# EAGLE board SimpleKeyboardTeensy (EAGLE 7.7.0), part 1 of 2
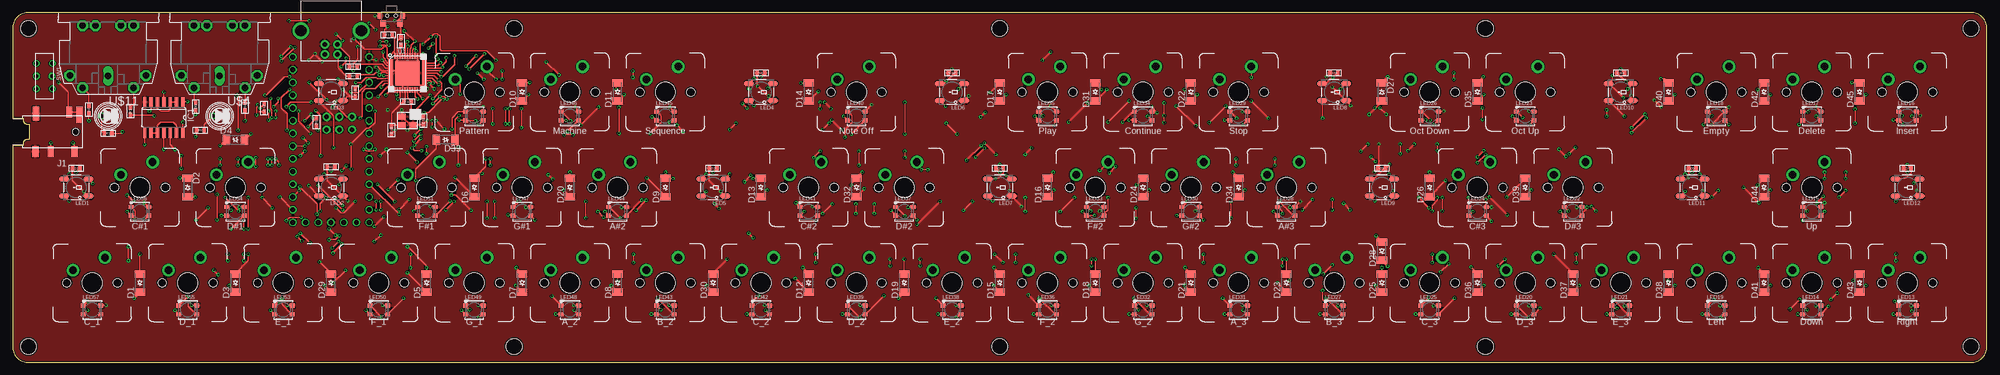
[diagram p3: board, top side]
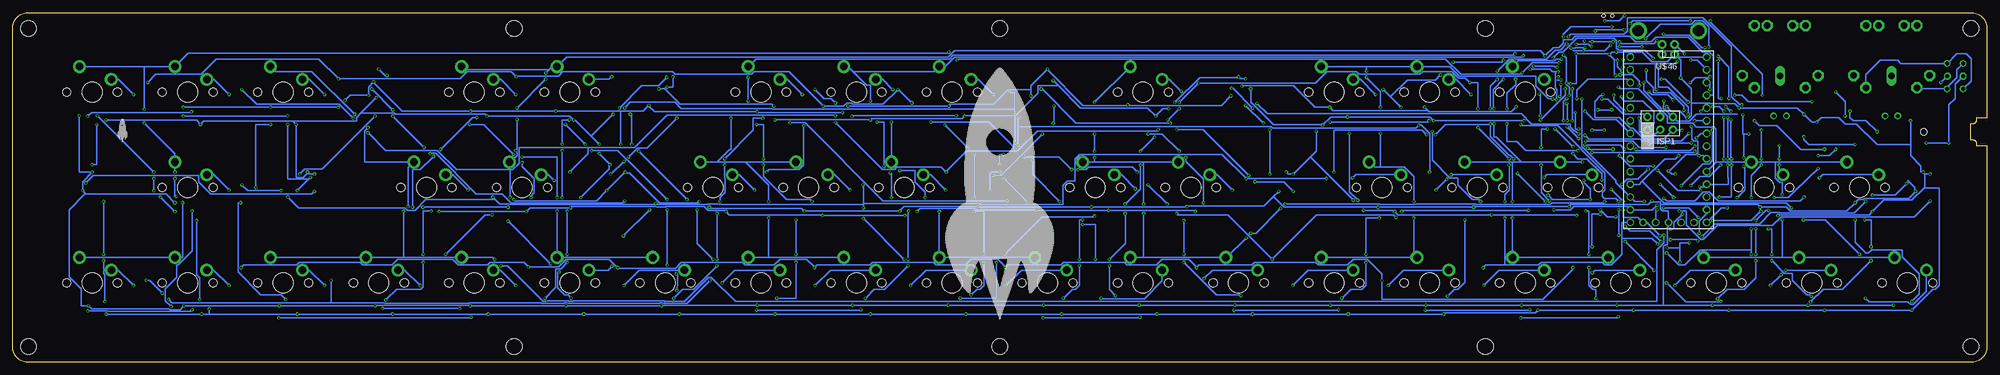
[diagram p4: board, bottom side, seen from below]

Size 393.7 x 69.85 mm. Coordinates in mm from the lower left corner, seen from the top.
Outline: 0,66.67 0,48.77 2.16,48.77 2.16,48.26 arc90 2.79,47.62 3.3,47.62 3.3,44.45 2.79,44.45 arc90 2.16,43.81 2.16,43.31 0,43.31 0,3.17 arc90 3.17,0 390.53,0 arc90 393.7,3.17 393.7,66.67 arc90 390.53,69.85 3.17,69.85 arc90 0,66.67
Copper layers (1*16): Top 0.035mm / dielectric 1.5mm / Bottom 0.035mm
Design rules "dirt_cheap_dirty_boards.v1": minimum track width 5mil, minimum drill 12mil, track to track 5mil, track to pad 5mil, pad to pad 5mil, via to via 5mil, smd to smd 0mil, copper to edge 10mil, drill to drill 10mil, minimum pad ring 10mil, minimum via ring 6mil, stop-mask expansion 2mil, vias tented up to drill 25mil, thermal gap 10mil
Net classes: 0 default: width 0.254 mm; 1 power: width 0.381 mm
Holes 3.2 mm at 3.17,66.67 3.17,3.17 390.53,66.67 196.85,3.17 196.85,66.67 390.53,3.17 100.01,3.17 100.01,66.67 293.69,3.17 293.69,66.67

## Footprints (pad centres in the part's own frame; a part is rotated, then mirrored left to right if it is on the bottom)
C0603 = smd 0.889 x 0.889: 1 -0.762,0; 2 0.762,0
SOD-123_MINI-SMA = smd 1.5 x 2.1: A 1.8,0; C -1.8,0
3MMLED = drill 0.8: + -1.27,0; - 1.27,0
SO14 = smd 0.66 x 2.032: 1 -3.81,-3.073; 2 -2.54,-3.073; 3 -1.27,-3.073; 4 0,-3.073; 5 1.27,-3.073; 6 2.54,-3.073; 7 3.81,-3.073; 8 3.81,3.073; 9 2.54,3.073; 10 1.27,3.073; 11 0,3.073; 12 -1.27,3.073; 13 -2.54,3.073; 14 -3.81,3.073
AVRISP = drill 0.9 pad 1.626: 1 -1.27,2.54; 2 1.27,2.54; 3 -1.27,0; 4 1.27,0; 5 -1.27,-2.54; 6 1.27,-2.54
6P-SMD-3.5 = smd 1.27 x 2.286: COM1 2.413,3.937; L -4.318,-3.937; R -0.635,3.937; RS -5.334,3.937 | smd 1.27 x 2.794: COM2 2.286,-3.683 | smd 1.27 x 3.302: LS -6.35,-3.429 | hole 1.27: -5.588,0
USB-B-PTH = drill 0.914 pad 1.676: D+ 0,1.25; D- 1.981,1.25; GND 0,-1.25; VBUS 1.981,-1.25 | drill 2.286: S1 -2.718,-6.02; S2 -2.718,6.02
WS2812B = smd 2 x 1.1: DIN -2.4,-1.7; DOUT 2.4,1.7; VDD 2.4,-1.7; VSS -2.4,1.7
LED3535 = smd 1 x 0.85: 1 -1.75,0.875; 2 -1.75,-0.875; 3 1.75,-0.875; 4 1.75,0.875
R0603 = smd 0.889 x 0.889: 1 -0.762,0; 2 0.762,0
6P-2CH-2.54-9.1X3.5X3.2+2H = drill 0.813 pad 1.27: CH1A -2.54,-1.6; CH1B 2.54,-1.6; CH2A -2.54,1.6; CH2B 2.54,1.6 | drill 0.813 pad 1.27 octagon: COM1 0,-1.6; COM2 0,1.524
MX1A-XXNW = drill 1.5 pad 2.54: 1 -3.81,2.54; 2 2.54,5.08 | hole 4: 0,0 | hole 1.7: -5.08,0; 5.08,0
QFN44 = smd 1 x 0.3: 1 -3.35,2.5; 2 -3.35,2; 3 -3.35,1.5; 4 -3.35,1; 5 -3.35,0.5; 6 -3.35,0; 7 -3.35,-0.5; 8 -3.35,-1; 9 -3.35,-1.5; 10 -3.35,-2; 11 -3.35,-2.5; 23 3.35,-2.5; 24 3.35,-2; 25 3.35,-1.5; 26 3.35,-1; 27 3.35,-0.5; 28 3.35,0; 29 3.35,0.5; 30 3.35,1; 31 3.35,1.5; 32 3.35,2; 33 3.35,2.5 | smd 0.3 x 1: 12 -2.5,-3.35; 13 -2,-3.35; 14 -1.5,-3.35; 15 -1,-3.35; 16 -0.5,-3.35; 17 0,-3.35; 18 0.5,-3.35; 19 1,-3.35; 20 1.5,-3.35; 21 2,-3.35; 22 2.5,-3.35; 34 2.5,3.35; 35 2,3.35; 36 1.5,3.35; 37 1,3.35; 38 0.5,3.35; 39 0,3.35; 40 -0.5,3.35; 41 -1,3.35; 42 -1.5,3.35; 43 -2,3.35; 44 -2.5,3.35 | smd 5.08 x 5.08: TAB 0,0
CP-2350 = drill 1.321 pad 2.184 octagon: 1 7.62,12.58; 3 -7.52,12.58; 4 5.08,15.02; 5 -5.08,15.02; PE -2.54,2.62; PE1 -5.08,2.62; PE2 5.08,2.62; PE@ 2.54,2.62 | drill 1.321 long: 2 0,12.68
TEENSY_3_AND_LC_SERIES_BOARDS_V1.4_TEENSY_3.0-3.2&LC_OUTER_ROW = drill 0.965: 0 -7.62,13.97; 1 -7.62,11.43; 2 -7.62,8.89; 3 -7.62,6.35; 3.3V 7.62,11.43; 3.3V1 -2.54,-16.51; 4 -7.62,3.81; 5 -7.62,1.27; 6 -7.62,-1.27; 7 -7.62,-3.81; 8 -7.62,-6.35; 9 -7.62,-8.89; 10 -7.62,-11.43; 11 -7.62,-13.97; 12 -7.62,-16.51; 13 7.62,-16.51; 14/A0 7.62,-13.97; 15/A1 7.62,-11.43; 16/A2 7.62,-8.89; 17/A3 7.62,-6.35; 18/A4 7.62,-3.81; 19/A5 7.62,-1.27; 20/A6 7.62,1.27; 21/A7 7.62,3.81; 22/A8 7.62,6.35; 23/A9 7.62,8.89; AGND 7.62,13.97; GND -7.62,16.51; GND1 0,-16.51; PGM 2.54,-16.51; RESET/DAC 5.08,-16.51; VBAT -5.08,-16.51; VIN 7.62,16.51
16MHZXTAL = smd 1.4 x 1.2: P$1 -1.1,-0.85; P$2 1.1,-0.85; P$3 1.1,0.85; P$4 -1.1,0.85
2X4TACT = smd 1.15 x 1.3: A -1.675,-1.55; B 1.675,-1.55 | smd 0.9 x 1.2: G1 -2.3,0; G2 2.3,0 | hole 0.7: -0.85,0; 0.85,0

## Placement (x,y rotation side)
C1  100n  [C0603]  12.7,38.73 0 top
C2  100n  [C0603]  63.5,39.05 0 top
C3  100n  [C0603]  139.7,38.73 0 top
C4  100n  [C0603]  196.85,38.73 0 top
C5  100n  [C0603]  273.05,38.73 0 top
C6  100n  [C0603]  334.96,38.73 0 top
C7  100n  [C0603]  377.82,38.73 0 top
C8  100n  [C0603]  149.23,57.78 0 top
C9  100n  [C0603]  263.53,57.78 0 top
C10  100n  [C0603]  187.33,57.78 0 top
C11  100n  [C0603]  320.68,57.78 0 top
C12  100n  [C0603]  50.16,50.8 90 top
C13  100n  [C0603]  77.47,64.14 90 top
C14  1u  [C0603]  68.33,53.85 270 top
C15  22p  [C0603]  81.91,48.26 270 top
C16  22p  [C0603]  75.56,46.35 270 top
D1  CGRM4001-G  [SOD-123_MINI-SMA]  25.4,15.88 90 top
D2  CGRM4001-G  [SOD-123_MINI-SMA]  34.92,34.92 270 top
D3  CGRM4001-G  [SOD-123_MINI-SMA]  44.45,15.88 90 top
D4  CGRM4001-G  [SOD-123_MINI-SMA]  44.45,44.45 0 top
D5  CGRM4001-G  [SOD-123_MINI-SMA]  82.55,15.88 90 top
D6  CGRM4001-G  [SOD-123_MINI-SMA]  92.08,34.92 90 top
D7  CGRM4001-G  [SOD-123_MINI-SMA]  101.6,15.88 90 top
D8  CGRM4001-G  [SOD-123_MINI-SMA]  120.65,15.88 90 top
D9  CGRM4001-G  [SOD-123_MINI-SMA]  130.18,34.92 90 top
D10  CGRM4001-G  [SOD-123_MINI-SMA]  101.6,53.97 90 top
D11  CGRM4001-G  [SOD-123_MINI-SMA]  120.65,53.97 90 top
D12  CGRM4001-G  [SOD-123_MINI-SMA]  158.75,15.88 90 top
D13  CGRM4001-G  [SOD-123_MINI-SMA]  149.23,34.92 90 top
D14  CGRM4001-G  [SOD-123_MINI-SMA]  158.75,53.97 90 top
D15  CGRM4001-G  [SOD-123_MINI-SMA]  196.85,15.88 90 top
D16  CGRM4001-G  [SOD-123_MINI-SMA]  206.38,34.92 90 top
D17  CGRM4001-G  [SOD-123_MINI-SMA]  196.85,53.97 90 top
D18  CGRM4001-G  [SOD-123_MINI-SMA]  215.9,15.88 90 top
D19  CGRM4001-G  [SOD-123_MINI-SMA]  177.8,15.88 90 top
D20  CGRM4001-G  [SOD-123_MINI-SMA]  111.12,34.92 90 top
D21  CGRM4001-G  [SOD-123_MINI-SMA]  234.95,15.88 90 top
D22  CGRM4001-G  [SOD-123_MINI-SMA]  234.95,53.97 90 top
D23  CGRM4001-G  [SOD-123_MINI-SMA]  254,15.88 90 top
D24  CGRM4001-G  [SOD-123_MINI-SMA]  225.43,34.92 90 top
D25  CGRM4001-G  [SOD-123_MINI-SMA]  273.05,15.88 90 top
D26  CGRM4001-G  [SOD-123_MINI-SMA]  282.57,34.92 90 top
D27  CGRM4001-G  [SOD-123_MINI-SMA]  273.05,53.97 270 top
D28  CGRM4001-G  [SOD-123_MINI-SMA]  273.05,22.23 90 top
D29  CGRM4001-G  [SOD-123_MINI-SMA]  63.5,15.88 90 top
D30  CGRM4001-G  [SOD-123_MINI-SMA]  139.7,15.88 90 top
D31  CGRM4001-G  [SOD-123_MINI-SMA]  215.9,53.97 90 top
D32  CGRM4001-G  [SOD-123_MINI-SMA]  168.28,34.92 90 top
D33  CGRM4001-G  [SOD-123_MINI-SMA]  86.36,44.45 180 top
D34  CGRM4001-G  [SOD-123_MINI-SMA]  244.48,34.92 90 top
D35  CGRM4001-G  [SOD-123_MINI-SMA]  292.1,53.97 90 top
D36  CGRM4001-G  [SOD-123_MINI-SMA]  292.1,15.88 90 top
D37  CGRM4001-G  [SOD-123_MINI-SMA]  311.15,15.88 90 top
D38  CGRM4001-G  [SOD-123_MINI-SMA]  330.2,15.88 90 top
D39  CGRM4001-G  [SOD-123_MINI-SMA]  301.62,34.92 90 top
D40  CGRM4001-G  [SOD-123_MINI-SMA]  330.2,53.97 90 top
D41  CGRM4001-G  [SOD-123_MINI-SMA]  349.25,15.88 90 top
D42  CGRM4001-G  [SOD-123_MINI-SMA]  349.25,53.97 90 top
D43  CGRM4001-G  [SOD-123_MINI-SMA]  368.3,15.88 90 top
D44  CGRM4001-G  [SOD-123_MINI-SMA]  349.25,34.92 90 top
D45  CGRM4001-G  [SOD-123_MINI-SMA]  368.3,53.97 90 top
D46  [3MMLED]  41.27,49.21 0 top
D47  [3MMLED]  19.05,49.21 0 top
IC1  74AC04D  [SO14]  30.16,48.89 180 top
ISP1  AVRISP-6  [AVRISP]  65.15,47.75 90 bottom
J1  AUDIO-CONNECTOR-6P-SMD-3440030P1  [6P-SMD-3.5]  6.98,46.04 180 top
JP1  USB-B  [USB-B-PTH]  63.5,63.5 270 top
LED1  WS2812B  [WS2812B]  12.7,34.92 180 top
LED2  WS2812B  [WS2812B]  63.5,34.92 180 top
LED3  WS2812B  [WS2812B]  63.5,53.97 180 top
LED4  WS2812B  [WS2812B]  149.23,53.97 180 top
LED5  WS2812B  [WS2812B]  139.7,34.92 180 top
LED6  WS2812B  [WS2812B]  187.33,53.97 180 top
LED7  WS2812B  [WS2812B]  196.85,34.92 180 top
LED8  WS2812B  [WS2812B]  263.53,53.97 180 top
LED9  WS2812B  [WS2812B]  273.05,34.92 180 top
LED10  WS2812B  [WS2812B]  320.68,53.97 180 top
LED11  WS2812B  [WS2812B]  334.96,34.92 180 top
LED12  WS2812B  [WS2812B]  377.82,34.92 180 top
LED13  WS2812B3535  [LED3535]  377.82,10.48 0 top
LED14  WS2812B3535  [LED3535]  358.78,10.48 0 top
LED15  WS2812B3535  [LED3535]  358.78,30.16 0 top
LED16  WS2812B3535  [LED3535]  377.82,49.21 0 top
LED17  WS2812B3535  [LED3535]  358.78,49.21 0 top
LED18  WS2812B3535  [LED3535]  339.73,49.21 0 top
LED19  WS2812B3535  [LED3535]  339.73,10.48 0 top
LED20  WS2812B3535  [LED3535]  301.62,10.48 0 top
LED21  WS2812B3535  [LED3535]  320.68,10.48 0 top
LED22  WS2812B3535  [LED3535]  311.15,30.16 0 top
LED23  WS2812B3535  [LED3535]  301.62,49.21 0 top
LED24  WS2812B3535  [LED3535]  292.1,30.16 0 top
LED25  WS2812B3535  [LED3535]  282.57,10.48 0 top
LED26  WS2812B3535  [LED3535]  282.57,49.21 0 top
LED27  WS2812B3535  [LED3535]  263.53,10.48 0 top
LED28  WS2812B3535  [LED3535]  254,30.16 0 top
LED29  WS2812B3535  [LED3535]  244.48,49.21 0 top
LED30  WS2812B3535  [LED3535]  234.95,30.16 0 top
LED31  WS2812B3535  [LED3535]  244.48,10.48 0 top
LED32  WS2812B3535  [LED3535]  225.43,10.48 0 top
LED33  WS2812B3535  [LED3535]  215.9,30.16 0 top
LED34  WS2812B3535  [LED3535]  225.43,49.21 0 top
LED35  WS2812B3535  [LED3535]  206.38,49.21 0 top
LED36  WS2812B3535  [LED3535]  206.38,10.48 0 top
LED37  WS2812B3535  [LED3535]  177.8,30.16 0 top
LED38  WS2812B3535  [LED3535]  187.33,10.48 0 top
LED39  WS2812B3535  [LED3535]  168.28,10.48 0 top
LED40  WS2812B3535  [LED3535]  168.28,49.21 0 top
LED41  WS2812B3535  [LED3535]  158.75,30.16 0 top
LED42  WS2812B3535  [LED3535]  149.23,10.48 0 top
LED43  WS2812B3535  [LED3535]  130.18,10.48 0 top
LED44  WS2812B3535  [LED3535]  120.65,30.16 0 top
LED45  WS2812B3535  [LED3535]  130.18,49.21 0 top
LED46  WS2812B3535  [LED3535]  111.12,49.21 0 top
LED47  WS2812B3535  [LED3535]  101.6,30.16 0 top
LED48  WS2812B3535  [LED3535]  111.12,10.48 0 top
LED49  WS2812B3535  [LED3535]  92.08,10.48 0 top
LED50  WS2812B3535  [LED3535]  73.02,10.48 0 top
LED51  WS2812B3535  [LED3535]  82.55,30.16 0 top
LED52  WS2812B3535  [LED3535]  92.08,49.21 0 top
LED53  WS2812B3535  [LED3535]  53.97,10.48 0 top
LED54  WS2812B3535  [LED3535]  44.45,30.16 0 top
LED55  WS2812B3535  [LED3535]  34.92,10.48 0 top
LED56  WS2812B3535  [LED3535]  25.4,30.16 0 top
LED57  WS2812B3535  [LED3535]  15.88,10.48 0 top
R1  330  [R0603]  19.05,45.72 180 top
R2  330  [R0603]  37.46,46.35 0 top
R3  220  [R0603]  23.5,50.16 270 top
R4  220  [R0603]  46.35,51.12 270 top
R5  220  [R0603]  15.24,50.48 90 top
R6  220  [R0603]  36.51,51.12 90 top
R7  22  [R0603]  67.94,57.15 180 top
R8  22  [R0603]  67.94,59.05 180 top
R9  10k  [R0603]  60.58,48.01 90 top
R10  1M  [R0603]  78.74,52.07 180 top
R11  10k  [R0603]  74.93,65.41 180 top
SW1  SWITCH-2CH-6P-3010010P1  [6P-2CH-2.54-9.1X3.5X3.2+2H]  6.35,57.15 270 top
SW46  C_1  [MX1A-XXNW]  15.88,15.88 0 top
SW47  C#1  [MX1A-XXNW]  25.4,34.92 0 top
SW48  D_1  [MX1A-XXNW]  34.92,15.88 0 top
SW49  D#1  [MX1A-XXNW]  44.45,34.92 0 top
SW50  E_1  [MX1A-XXNW]  53.97,15.88 0 top
SW51  F_1  [MX1A-XXNW]  73.02,15.88 0 top
SW52  F#1  [MX1A-XXNW]  82.55,34.92 0 top
SW53  G_1  [MX1A-XXNW]  92.08,15.88 0 top
SW54  G#1  [MX1A-XXNW]  101.6,34.92 0 top
SW55  A_2  [MX1A-XXNW]  111.12,15.88 0 top
SW56  A#2  [MX1A-XXNW]  120.65,34.92 0 top
SW57  B_2  [MX1A-XXNW]  130.18,15.88 0 top
SW58  C_2  [MX1A-XXNW]  149.23,15.88 0 top
SW59  C#2  [MX1A-XXNW]  158.75,34.92 0 top
SW60  D_2  [MX1A-XXNW]  168.28,15.88 0 top
SW61  D#2  [MX1A-XXNW]  177.8,34.92 0 top
SW62  E_2  [MX1A-XXNW]  187.33,15.88 0 top
SW63  F_2  [MX1A-XXNW]  206.38,15.88 0 top
SW64  F#2  [MX1A-XXNW]  215.9,34.92 0 top
SW65  G_2  [MX1A-XXNW]  225.43,15.88 0 top
SW66  G#2  [MX1A-XXNW]  234.95,34.92 0 top
SW67  A_3  [MX1A-XXNW]  244.48,15.88 0 top
SW68  A#3  [MX1A-XXNW]  254,34.92 0 top
SW69  B_3  [MX1A-XXNW]  263.53,15.88 0 top
SW70  C_3  [MX1A-XXNW]  282.57,15.88 0 top
SW71  C#3  [MX1A-XXNW]  292.1,34.92 0 top
SW72  D_3  [MX1A-XXNW]  301.62,15.88 0 top
SW73  D#3  [MX1A-XXNW]  311.15,34.92 0 top
SW74  E_3  [MX1A-XXNW]  320.68,15.88 0 top
SW75  Right  [MX1A-XXNW]  377.82,15.88 0 top
SW76  Up  [MX1A-XXNW]  358.78,34.92 0 top
SW77  Down  [MX1A-XXNW]  358.78,15.88 0 top
SW78  Stop  [MX1A-XXNW]  244.48,53.97 0 top
SW79  Oct Down  [MX1A-XXNW]  282.57,53.97 0 top
SW80  Left  [MX1A-XXNW]  339.73,15.88 0 top
SW81  Play  [MX1A-XXNW]  206.38,53.97 0 top
SW82  Continue  [MX1A-XXNW]  225.43,53.97 0 top
SW83  Note Off  [MX1A-XXNW]  168.28,53.97 0 top
SW84  Empty  [MX1A-XXNW]  339.73,53.97 0 top
SW85  Oct Up  [MX1A-XXNW]  301.62,53.97 0 top
SW86  Delete  [MX1A-XXNW]  358.78,53.97 0 top
SW87  Insert  [MX1A-XXNW]  377.82,53.97 0 top
SW88  Sequence  [MX1A-XXNW]  130.18,53.97 0 top
SW89  Pattern  [MX1A-XXNW]  92.08,53.97 0 top
SW90  Machine  [MX1A-XXNW]  111.12,53.97 0 top
U1  ATMEGA32U4-MU  [QFN44]  78.74,57.78 0 top
U$4  MIDIJACK  [CP-2350]  41.27,69.85 180 top
U$11  MIDIJACK  [CP-2350]  19.05,69.85 180 top
U$15  BUBBLESDSA_1U  [BUBBLES]  63.5,34.92 0 top
U$16  BUBBLESDSA_1U  [BUBBLES]  139.7,34.92 0 top
U$17  BUBBLESDSA_1U  [BUBBLES]  196.85,34.92 0 top
U$18  BUBBLESDSA_1U  [BUBBLES]  273.05,34.92 0 top
U$19  BUBBLESDSA_1U  [BUBBLES]  377.82,34.92 0 top
U$20  BUBBLESDSA_1U  [BUBBLES]  330.2,34.92 0 top
U$21  BUBBLESDSA_1U_HALF  [BUBBLES_HALF]  9.52,34.92 0 top
U$22  BUBBLESDSA_1U_HALF  [BUBBLES_HALF]  342.9,34.92 180 top
U$28  BUBBLESINV  [BUBBLES_INV]  73.02,53.97 0 top
U$29  BUBBLESINV  [BUBBLES_INV]  149.23,53.97 90 top
U$30  BUBBLESINV  [BUBBLES_INV]  187.33,53.97 0 top
U$31  BUBBLESINV  [BUBBLES_INV]  263.53,53.97 0 top
U$32  BUBBLESINV  [BUBBLES_INV]  320.68,53.97 0 top
U$33  BUBBLESDSA_1U_HALF  [BUBBLES_HALF]  63.5,53.97 180 top
U$34  BUBBLESONE  [BUBBLES_ONE]  327.03,44.45 0 top
U$35  BUBBLESONE  [BUBBLES_ONE]  193.68,44.45 0 top
U$36  BUBBLESONE  [BUBBLES_ONE]  79.38,50.8 90 top
U$37  BUBBLESONE  [BUBBLES_ONE]  142.88,44.45 0 top
U$38  BUBBLESONE  [BUBBLES_ONE]  66.67,44.45 0 top
U$39  BUBBLESONE  [BUBBLES_ONE]  57.15,53.97 0 top
U$40  BUBBLESONE  [BUBBLES_ONE]  57.15,47.62 0 top
U$41  BUBBLESONE  [BUBBLES_ONE]  57.15,60.32 0 top
U$42  BUBBLESONE  [BUBBLES_ONE]  269.88,44.45 0 top
U$43  BUBBLESONE  [BUBBLES_ONE]  346.07,31.75 0 top
U$44  BUBBLESONE  [BUBBLES_ONE]  346.07,38.1 0 top
U$45  [ROCKET-5CM]  196.85,31.75 0 bottom
U$46  TEENSY_3_AND_LC_SERIES_BOARDS_V1.4_TEENSY_LC_OUTER_ROW  [TEENSY_3_AND_LC_SERIES_BOARDS_V1.4_TEENSY_3.0-3.2&LC_OUTER_ROW]  63.5,44.45 0 bottom
U$60  RESONATOR  [16MHZXTAL]  78.74,48.26 180 top
U$61  2PSWITCH_SMT_SIDEMOUNT  [2X4TACT]  75.56,69.22 0 top
U$63  TINRS_ARTWORKTINYDATE  [JUSTATINYROCKET_DATECODE]  371.79,46.35 0 bottom

## Tracks (layer width: path | path; a pad name or v marks a point on that pad's centre or on a via)
3.3V  (via drill 0.3)
  Top 0.254: v60.96,35.31 v65.79,30.48 | v54.74,46.35 54.74,49.66 53.59,50.8 53.59,52.83 v55.24,54.48
  Bottom 0.254: U$46.3.3V1 66.04,30.48 v65.79,30.48 | v60.96,35.31 56.64,39.62 55.37,39.62 54.74,40.26 v54.74,46.35 | v55.24,54.48 55.24,55.88 U$46.3.3V
5V  (via drill 0.3)
  Top 0.254: U1.44 76.24,62.23 | 76.24,62.23 76.24,64.86 R11.1 | U1.7 74.18,57.28 v74.04,57.28 | v75.31,61.47 75.48,61.47 76.24,62.23 | U1.2 74.83,59.78 74.3,60.32 74.3,60.58 73.91,60.96 v73.91,61.98 | 81.28,63.63 81.24,63.59 U1.34 81.28,61.59 v81.91,61.59 | U1.24 82.9,55.78 v83.06,55.63 v84.07,54.61 | v89.03,48.39 90.27,48.39 LED52.2 90.42,48.26 v92.33,48.26 | U1.14 77.24,52.98 v76.83,52.58 | LED3.VDD 61.1,56.76 v61.09,56.77 | v59.82,48.77 R9.2 v58.93,47.12 | v14.99,10.41 14.22,9.65 LED57.2 | v32.38,10.41 33.15,9.65 LED55.2 | v51.43,10.41 52.2,9.65 LED53.2 | v70.48,10.41 71.25,9.65 LED50.2 | v89.53,10.41 90.3,9.65 LED49.2 | v108.33,9.65 109.35,9.65 LED48.2 | v127.38,9.65 128.4,9.65 LED43.2 | v146.43,9.65 147.45,9.65 LED42.2 | v165.48,9.65 166.5,9.65 LED39.2 | v184.53,9.65 185.55,9.65 LED38.2 | v203.58,9.65 204.6,9.65 LED36.2 | v222.63,9.65 223.65,9.65 LED32.2 | v241.68,9.65 242.7,9.65 LED31.2 | v260.73,9.65 261.75,9.65 LED27.2 | v279.78,9.65 280.8,9.65 LED25.2 | v298.83,9.65 299.85,9.65 LED20.2 | v317.88,9.65 318.9,9.65 LED21.2 | v336.93,9.65 337.95,9.65 LED19.2 | v355.98,9.65 357,9.65 LED14.2 | v357,28.32 357,29.21 LED15.2 | v354.46,10.67 v356.36,12.57 | v375.03,9.65 376.05,9.65 LED13.2 | v291.21,30.1 290.45,29.34 LED24.2 | v308.61,30.1 309.37,29.34 LED22.2 | C9.2 264.03,57.78 263.21,56.96 | 263.21,56.96 262,55.75 261.24,55.75 LED8.VDD | LED9.VDD 270.76,36.7 271.53,36.7 273.56,38.73 C5.2 v274.57,39.5 | v281.81,48.39 280.92,48.39 LED26.2 | v299.09,49.15 299.85,48.39 LED23.2 | v276.73,43.56 v276.73,41.66 | v273.94,49.53 v272.67,50.8 | v263.27,56.9 263.21,56.96 | v280.42,32.89 v282.45,30.86 | LED12.VDD 375.54,36.7 377.44,36.7 378.59,37.85 C7.2 v377.82,39.5
  Top 0.254: v376.94,47.5 376.17,48.26 LED16.2 376.05,48.39 v375.03,48.39 | v320.68,58.55 C11.2 | v319.02,57.28 319.02,56.39 318.39,55.75 LED10.VDD 318.39,55.63 v321.18,52.83 | v334.9,37.97 335.66,38.73 C6.2 | v333.5,37.59 332.61,36.7 LED11.VDD | v337.19,47.5 337.95,48.26 LED18.2 | v356.24,47.5 357,48.26 LED17.2 | v215.77,29.34 214.25,29.34 LED33.2 214.12,29.34 v213.36,30.1 | v232.16,29.34 233.17,29.34 LED30.2 | v251.46,30.1 252.22,29.34 LED28.2 | v157.86,30.1 157.1,29.34 LED41.2 | v175.13,30.35 176.15,29.34 LED37.2 | LED7.VDD 194.56,36.7 v195.96,36.7 196.47,36.7 197.61,37.85 C4.2 v196.85,39.5 | C10.2 187.83,57.78 186.25,56.2 | 186.25,56.2 185.8,55.75 185.04,55.75 LED6.VDD | v165.74,49.15 166.5,48.39 LED40.2 | v186.18,56.26 186.25,56.2 | v203.84,49.15 204.6,48.39 LED35.2 | v222.63,48.39 223.65,48.39 LED34.2 | v241.68,48.39 242.7,48.39 LED29.2 | v193.8,43.81 v196.09,41.53 | v191.39,32.13 v189.61,30.35 | v81.79,29.34 80.9,29.34 LED51.2 | v98.81,29.46 99.69,29.46 99.82,29.34 LED47.2 | v118.11,30.1 118.87,29.34 LED44.2 | v149.23,57.02 C8.2 | v147.83,56.64 146.94,55.75 LED4.VDD 146.81,55.63 v146.81,54.61 | v139.7,37.97 C3.2 | v138.3,37.59 137.41,36.7 LED5.VDD | v110.36,48.26 109.47,48.26 LED46.2 | v127.51,49.02 127.76,49.02 128.4,48.39 LED45.2 | v132.46,47.37 v133.73,46.1 | v126.36,32.38 v124.33,30.35 | v12.7,37.97 C1.2 | v11.3,37.59 10.41,36.7 LED1.VDD | v22.86,30.1 23.62,29.34 LED56.2 | v41.66,29.34 42.67,29.34 LED54.2 | v63.5,38.23 64.26,38.99 C2.2 | v62.1,37.59 61.21,36.7 LED2.VDD | v49.4,50.8 C12.2 | ISP1.2 66.67,49.02 64.64,51.05 v63.88,51.05 | v161.93,51.94 v163.2,50.67 | R5.1 v15.24,48.26 | IC1.14 v33.97,47.94 | v36.51,49.53 R6.1
  Bottom 0.254: v74.04,57.28 74.3,57.66 74.3,60.45 v75.31,61.47 | v75.31,61.47 74.8,61.98 v73.91,61.98 68.71,61.98 66.8,60.07 63.75,60.07 62.36,61.47 JP1.VBUS | v84.07,54.61 84.07,53.34 v89.03,48.39 | v76.83,52.58 75.56,52.58 72.52,49.53 68.2,49.53 ISP1.2 | JP1.VBUS 61.09,60.36 v61.09,56.77 58.93,54.61 58.93,51.82 | U$46.VIN 61.69,60.96 JP1.VBUS | 58.93,51.82 58.93,49.28 59.44,48.77 v59.82,48.77 61.21,50.16 62.99,50.16 v63.88,51.05 | 354.46,9.65 v336.93,9.65 v317.88,9.65 v298.83,9.65 v279.78,9.65 v260.73,9.65 v241.68,9.65 v222.63,9.65 v203.58,9.65 v184.53,9.65 v165.48,9.65 v146.43,9.65 v127.38,9.65 v108.33,9.65 108.08,9.91 90.04,9.91 v89.53,10.41 v70.48,10.41 v51.43,10.41 v32.38,10.41 v14.99,10.41 10.79,14.61 10.29,14.61 9.52,15.37 9.52,34.8 12.45,34.8 12.51,34.86 | 354.46,9.65 v355.98,9.65 v375.03,9.65 | v357,28.32 357,17.53 356.36,16.89 v356.36,12.57 | 354.46,9.65 v354.46,10.67 | v308.61,30.1 v291.21,30.1 290.45,30.86 v282.45,30.86 282.19,31.12 265.43,31.12 265.3,30.99 263.53,30.99 263.4,31.12 255.78,31.12 255.02,30.35 251.71,30.35 v251.46,30.1 250.83,29.46 232.28,29.46 v232.16,29.34 v215.77,29.34 | v276.73,41.66 v274.57,39.5 274.7,39.5 274.7,38.61 v280.42,32.89 | 278.32,45.15 281.56,48.39 v281.81,48.39 282.57,49.15 v299.09,49.15 299.47,49.53 317.37,49.53 317.63,49.78 324.1,49.78 324.17,49.85 | 278.32,45.15 v276.73,43.56 | v263.27,56.9 264.92,55.24 268.22,55.24 v272.67,50.8 | 278.32,45.15 v273.94,49.53 | v376.94,47.5 376.94,39.5 v377.82,39.5 | v320.68,58.55 319.41,57.28 v319.02,57.28 | v333.5,37.59 334.52,37.59 v334.9,37.97 334.9,37.85 335.79,36.96 337.19,36.96 v337.19,47.5 337.76,48.07
  Bottom 0.254: 337.76,48.07 337.82,48.13 355.6,48.13 v356.24,47.5 356.24,47.62 357,48.39 v375.03,48.39 | 324.17,49.85 325.12,48.89 325.12,48.13 337.69,48.13 337.76,48.07 | 324.17,49.85 v321.18,52.83 | v157.86,30.1 158.12,30.35 v175.13,30.35 v189.61,30.35 189.74,30.48 201.42,30.48 201.68,30.73 212.73,30.73 v213.36,30.1 | v186.18,56.26 185.23,55.31 | 185.23,55.31 180.72,50.8 167.39,50.8 v165.74,49.15 165.74,49.28 164.34,50.67 v163.2,50.67 | 193.8,49.28 193.68,49.28 189.23,53.72 189.23,55.24 185.29,55.24 185.23,55.31 | 193.8,49.28 203.71,49.28 v203.84,49.15 204.34,48.64 222.38,48.64 v222.63,48.39 222.63,48.51 241.55,48.51 v241.68,48.39 | v196.85,39.5 196.85,41.53 v196.09,41.53 | 193.8,49.28 v193.8,43.81 | v195.96,36.7 v191.39,32.13 | v81.79,29.34 81.91,29.46 v98.81,29.46 117.47,29.46 v118.11,30.1 118.36,30.35 v124.33,30.35 | v147.83,56.64 148.84,56.64 v149.23,57.02 149.23,56.9 156.97,56.9 v161.93,51.94 | v139.7,37.97 139.32,37.59 v138.3,37.59 134.94,40.96 | 134.94,40.96 133.73,42.16 v133.73,46.1 | v146.81,54.61 146.81,51.82 146.56,51.82 142.24,47.5 132.46,47.5 v132.46,47.37 130.81,49.02 v127.51,49.02 111.12,49.02 v110.36,48.26 v92.33,48.26 | 134.94,40.96 v126.36,32.38 | 12.38,37.65 12.32,37.59 v11.3,37.59 | 12.38,37.65 v12.7,37.97 13.21,37.97 13.21,39.24 15.24,41.27 15.24,43.5 | 12.51,34.86 12.45,34.92 12.45,37.59 12.38,37.65 | 12.51,34.86 14.99,32.38 20.57,32.38 v22.86,30.1 23.5,29.46 41.53,29.46 v41.66,29.34 | v75.31,61.47 75.31,61.59 v81.91,61.59 81.91,55.63 v83.06,55.63 | v62.1,37.59 62.86,37.59 v63.5,38.23 63.37,38.23 60.07,41.53 58.04,41.53 57.66,41.91 57.66,44.2 58.42,44.2 58.8,44.58 58.8,47.12 v58.93,47.12
  Bottom 0.254: 58.93,51.82 55.37,51.82 55.24,51.69 50.29,51.69 v49.4,50.8 37.78,50.8 v36.51,49.53 34.92,47.94 v33.97,47.94 33.02,48.89 29.53,48.89 28.26,47.62 26.04,47.62 21.91,43.5 15.24,43.5 | v15.24,48.26 15.24,43.5
COL1  (via drill 0.3)
  Top 0.254: U1.36 80.24,61.95 v80.52,62.23 | v273.05,18.92 D25.A | v290.83,19.05 292.1,17.78 D36.A | v348.11,18.92 349.25,17.78 D41.A | v75.06,63.37 73.53,63.37 v73.28,63.12 | v68.83,62.99 68.83,60.45 67.94,59.56 v67.94,58.29 | v60.45,50.29 61.47,49.28 v61.47,41.27 | v25.4,21.59 D1.A | v38.99,30.86 v36.58,28.45 | D5.A v82.55,18.92 82.55,19.3 v78.74,23.11 | U$46.9 v77.09,29.59 | v120.65,16.38 D8.A | v157.61,18.92 158.75,17.78 D12.A | v195.71,18.92 196.85,17.78 D15.A | v233.81,18.92 234.95,17.78 D21.A
  Bottom 0.254: 82.55,62.23 v80.52,62.23 76.2,62.23 v75.06,63.37 | v348.11,18.92 347.6,19.43 337.06,19.43 336.55,19.94 324.36,19.94 323.85,19.43 318.01,19.43 316.87,20.57 305.94,20.57 304.8,19.43 298.96,19.43 298.45,19.94 291.72,19.94 v290.83,19.05 284.86,19.05 283.34,20.57 274.7,20.57 v273.05,18.92 272.92,18.8 261.49,18.8 260.35,19.94 248.16,19.94 247.65,19.43 241.81,19.43 240.67,20.57 235.33,20.57 233.81,19.05 v233.81,18.92 233.3,19.43 222.76,19.43 222.25,19.94 210.06,19.94 209.55,19.43 203.71,19.43 202.56,20.57 197.23,20.57 195.71,19.05 v195.71,18.92 195.2,19.43 184.66,19.43 184.15,19.94 171.96,19.94 171.45,19.43 165.61,19.43 164.47,20.57 159.13,20.57 157.61,19.05 v157.61,18.92 157.1,19.43 146.56,19.43 146.05,19.94 133.86,19.94 133.35,19.43 127.51,19.43 126.36,20.57 123.57,20.57 120.65,17.65 v120.65,16.38 120.65,12.57 88.52,12.57 82.55,18.54 v82.55,18.92 | v73.28,63.12 73.15,62.99 v68.83,62.99 | v67.94,58.29 67.94,56.26 66.55,54.86 66.55,53.85 63.12,53.85 60.45,51.18 v60.45,50.29 | v61.47,41.27 62.1,40.64 64.26,40.64 68.77,36.13 | 68.77,36.13 69.34,35.56 U$46.9 | v25.4,21.59 32.26,28.45 v36.58,28.45 | v38.99,30.86 40,31.88 64.39,31.88 68.58,36.07 68.71,36.07 68.77,36.13 | v78.74,23.11 78.74,29.59 v77.09,29.59
COL2  (via drill 0.3)
  Top 0.254: U1.37 79.74,62.47 v80.14,62.86 | v36.45,33.02 34.92,33.02 D2.A | v65.79,31.37 v64.39,32.77 | v131.7,36.7 130.18,36.7 D9.A v130.18,37.97 | v147.7,36.7 149.23,36.7 D13.A | v83.82,63.63 v82.93,62.74 | v97.66,56.52 v97.66,58.17 | v99.06,47.62 v99.06,50.67 | v94.36,40.64 94.36,39.12 93.28,38.04 | 93.28,38.04 92.08,36.83 D6.A | v109.98,45.47 v111.76,45.47 | v88.01,32.13 v86.36,30.48 | 93.28,38.04 v93.6,37.72 | v215.9,20.57 D18.A | v224.03,30.86 v224.03,28.7 | v224.16,35.43 225.43,36.7 D24.A | v271.91,25.27 273.05,24.13 D28.A | v265.43,31.75 v266.7,30.48 | v297.94,33.02 301.62,36.7 D39.A | v347.98,35.43 349.25,36.7 D44.A | v338.84,33.02 v340.11,34.29
  Bottom 0.254: v80.14,62.86 82.04,62.86 82.17,62.74 v82.93,62.74 | v36.45,33.02 37.21,32.26 53.59,32.26 55.37,34.04 56.52,34.04 58.29,32.26 63.88,32.26 v64.39,32.77 | v65.79,31.37 66.67,30.48 U$46.11 71.75,31.12 82.42,31.12 83.06,30.48 v86.36,30.48 | v131.7,36.7 v147.7,36.7 152.53,41.53 180.98,41.53 181.86,40.64 181.86,36.2 183.39,36.2 184.28,35.31 184.28,31.5 200.66,31.5 200.91,31.75 224.03,31.75 | v83.82,63.63 85.09,62.36 86.11,62.36 87.88,60.58 95.25,60.58 v97.66,58.17 | v97.66,56.52 99.06,55.12 v99.06,50.67 | 99.06,47.5 99.06,45.08 95.25,41.27 95,41.27 v94.36,40.64 | v130.18,37.97 130.18,46.35 112.65,46.35 v111.76,45.47 | v109.98,45.47 107.95,47.5 99.06,47.5 | 99.06,47.5 v99.06,47.62 | v93.6,37.72 v88.01,32.13 | v224.03,28.7 v215.9,20.57 | 224.03,31.75 224.03,35.43 v224.16,35.43 | 224.03,31.75 224.03,31.5 | 224.03,31.5 v224.03,30.86 | v266.7,30.48 v271.91,25.27 | 224.03,31.5 252.86,31.5 252.98,31.62 255.02,31.62 255.14,31.5 265.18,31.5 v265.43,31.75 265.3,31.5 294.51,31.5 294.64,31.62 296.55,31.62 297.5,32.58 | 297.5,32.58 v297.94,33.02 | v347.98,35.43 346.84,34.29 v340.11,34.29 | v338.84,33.02 336.68,30.86 315.47,30.86 314.96,30.35 313.44,30.35 311.28,32.51 297.56,32.51 297.5,32.58
COL3  (via drill 0.3)
  Top 0.254: U1.38 79.24,62.6 79.5,62.86 79.5,63.37 v80.26,64.14 80.14,64.14 v78.11,66.17 | v100.46,18.92 101.6,17.78 D7.A | v71.12,67.69 v72.39,66.42 | v55.12,68.2 v59.18,68.2 | v44.96,39.37 v44.96,40.64 | v46.99,26.67 v46.99,32.89 | v46.99,21.59 46.99,20.32 44.45,17.78 D3.A | v63.88,21.84 v65.66,23.62 | v103.12,55.88 101.6,55.88 D10.A | v157.23,55.75 158.75,55.75 D14.A | v207.52,37.97 206.38,36.83 D16.A | v229.62,51.82 v229.62,49.28 v229.62,47.88 | v233.68,54.48 234.95,55.75 D22.A | v282.57,37.97 D26.A | v307.34,21.59 311.15,17.78 D37.A | v294.51,33.02 v298.07,29.46 | v347.98,54.48 349.25,55.75 D42.A | v322.83,45.85 v325.75,48.77 | v161.04,50.67 v161.04,51.94 | v165.23,46.48 v163.32,48.39 | v96.14,32.13 v96.14,28.83 | v95.25,40.64 v95.25,39.37 | v101.47,50.67 v101.47,46.86 | v44.96,46.35 44.96,53.15 v44.77,53.34
  Bottom 0.254: v80.26,64.14 80.39,64.14 80.52,64.26 | v100.46,18.92 99.95,19.43 96.14,19.43 | 96.14,19.43 89.41,19.43 88.9,19.94 76.71,19.94 76.2,19.43 74.93,19.43 72.77,21.59 72.77,24.77 | 72.77,24.77 72.77,27.94 U$46.12 | v78.11,66.17 77.85,66.42 v72.39,66.42 | v71.12,67.69 70.61,68.2 v59.18,68.2 | v55.12,68.2 55.12,67.94 44.77,57.59 v44.77,53.34 | v44.96,40.64 v44.96,46.35 | v44.96,39.37 46.99,37.34 v46.99,32.89 | v46.99,21.59 46.99,22.48 | 46.99,22.48 v46.99,26.67 | 72.77,24.77 66.8,24.77 v65.66,23.62 | v63.88,21.84 61.47,19.43 60.2,19.43 57.15,22.48 46.99,22.48 | v229.62,47.88 220.22,38.48 217.81,38.48 217.3,38.99 208.53,38.99 v207.52,37.97 207.52,38.1 203.45,42.16 193.42,42.16 189.36,46.23 165.48,46.23 v165.23,46.48 | v229.62,51.82 230.51,52.7 231.9,52.7 v233.68,54.48 | v282.57,37.97 278.89,41.66 278.89,42.93 | 278.89,42.93 269.62,42.93 263.14,49.4 229.74,49.4 v229.62,49.28 | v307.34,21.59 299.47,29.46 v298.07,29.46 | 294.51,38.48 v294.51,33.02 | 294.51,38.48 294,38.48 292.74,39.75 292.74,42.93 278.89,42.93 | v347.98,54.48 345.06,51.56 328.55,51.56 v325.75,48.77 | v322.83,45.85 319.28,42.29 308.99,42.29 305.18,38.48 294.51,38.48 | v161.04,51.94 v157.23,55.75 133.86,55.75 131.57,58.04 125.73,58.04 125.22,57.53 113.03,57.53 112.52,58.04 106.68,58.04 105.41,56.77 104.01,56.77 v103.12,55.88 101.47,55.88 v101.47,50.67 | v163.32,48.39 v161.04,50.67 | v96.14,28.83 96.14,19.43 | v96.14,32.13 96.14,33.66 96.01,33.66 95.25,34.42 v95.25,39.37 | v101.47,46.86 v95.25,40.64
COL4  (via drill 0.3)
  Top 0.254: U1.39 78.74,62.99 v78.87,63.12 | v330.2,16.38 D38.A | v363.86,13.84 v362.59,12.57 | v367.03,16.38 368.3,17.65 D43.A | v254,20.57 D23.A 254,17.65 254.64,17.02 v254.64,16.38 | v259.21,32.51 v257.18,30.48 | v270.26,43.56 v268.86,42.16 | 271.72,50.74 273.05,52.07 D27.A | 271.72,50.74 v270.51,49.53 | v81.91,63.5 v83.44,65.02 84.07,65.66 84.71,65.66 85.22,65.15 85.22,62.48 85.47,62.23 94.49,62.23 v96.39,60.32 | v48.89,51.43 48.89,51.18 48.64,50.93 v48.64,49.4 | v47.5,45.59 46.35,44.45 D4.A | v49.78,32.89 v51.82,30.86 | v48.51,40.89 v48.51,39.12 | v111.12,37.97 D20.A | v116.84,50.93 v113.28,47.37 | v120.4,54.48 120.4,55.5 120.65,55.75 D11.A | v177.8,20.57 D19.A | v184.91,32.13 v180.34,27.56 | v193.17,43.31 v190.25,40.39 | v193.93,49.91 v193.04,49.02 | v194.95,53.85 196.85,55.75 D17.A | v108.97,57.4 v106.43,59.94 | v271.65,50.8 271.72,50.74
  Bottom 0.254: v78.87,63.12 79.12,63.12 79.5,63.5 v81.91,63.5 | 330.2,11.94 v330.2,16.38 | 330.2,11.94 361.95,11.94 v362.59,12.57 | v363.86,13.84 366.4,16.38 v367.03,16.38 | v254,20.57 257.18,23.75 v257.18,30.48 | v268.86,42.16 v259.21,32.51 | v270.26,43.56 270.26,49.53 v270.51,49.53 | 330.2,11.94 319.66,11.94 319.53,11.81 302.77,11.81 302.64,11.94 288.29,11.94 288.16,11.81 283.72,11.81 283.59,11.94 283.08,11.94 282.96,11.81 264.67,11.81 264.54,11.94 264.03,11.94 263.91,11.81 259.21,11.81 v254.64,16.38 | v83.44,65.02 82.93,65.53 72.39,65.53 71.75,66.17 71.75,68.83 56.64,68.83 50.93,63.12 50.93,53.09 49.28,51.43 v48.89,51.43 | v48.64,49.4 48.64,45.59 48.51,45.59 | v47.5,45.59 48.51,45.59 | U$46.13 52.96,30.86 v51.82,30.86 | v49.78,32.89 48.26,34.42 48.26,39.12 v48.51,39.12 | 48.51,45.59 v48.51,40.89 | v111.12,37.97 111.12,45.72 112.78,47.37 v113.28,47.37 113.92,46.74 142.37,46.74 142.75,47.12 193.17,47.12 | v120.4,54.48 118.94,53.02 | 118.94,53.02 v116.84,50.93 | v177.8,20.57 177.8,27.56 v180.34,27.56 | v184.91,32.13 190.25,37.46 v190.25,40.39 | 193.17,47.12 193.17,49.02 v193.04,49.02 | 193.17,47.12 v193.17,43.31 | 193.93,50.55 193.93,53.85 v194.95,53.85 | 193.93,50.55 v193.93,49.91 | v96.39,60.32 96.77,59.94 v106.43,59.94 | v108.97,57.4 109.98,56.39 115.57,56.39 118.94,53.02 | v271.65,50.8 270.51,51.94 261.62,51.94 260.35,50.67 242.32,50.67 242.19,50.55 193.93,50.55
COL5  (via drill 0.3)
  Top 0.254: U1.40 78.24,63.51 v78.74,64.01 | v142.49,20.57 139.7,17.78 D30.A | v163.45,31.62 v161.54,29.72 | v167.26,35.43 167.26,35.69 168.28,36.7 D32.A 168.28,36.83 v169.42,37.97 | v73.28,64.01 v74.55,64.01 | v64.52,65.53 v65.79,64.26 | v53.59,60.2 v56.26,62.86 | v52.96,52.7 52.96,51.94 v52.07,51.05 | v51.05,48.39 v51.05,50.16 | v50.93,39.37 v50.93,40.64 | U$46.14/A0 v53.34,33.02 | v61.21,20.07 63.5,17.78 D29.A | v57.4,25.78 v59.31,23.88 | v80.39,36.32 80.39,38.61 84.45,42.67 84.45,44.45 D33.A | v77.09,30.48 v79.12,32.51 | v72.14,27.18 v74.04,29.08 | v63.75,22.86 v65.02,24.13 | v116.71,30.1 v117.86,28.96 | v91.44,30.35 88.39,33.4 v87.5,33.4 | v243.33,37.97 244.48,36.83 D34.A | v232.03,51.18 v235.97,47.24 | v217.17,54.48 215.9,55.75 D31.A | v293.24,57.02 292.1,55.88 D35.A | v328.68,56.64 329.44,56.64 330.2,55.88 D40.A | v366.78,55.88 368.3,55.88 D45.A | v182.5,38.48 v181.23,38.48 | v193.8,42.8 v192.02,41.02 | v214.38,51.82 v210.57,48.01
  Bottom 0.254: 79.38,64.01 v78.74,64.01 v74.55,64.01 | v161.54,29.72 161.29,29.46 151.38,29.46 v142.49,20.57 142.49,20.7 133.73,29.46 118.36,29.46 v117.86,28.96 | v167.26,35.43 v163.45,31.62 | v73.28,64.01 72.9,63.63 66.42,63.63 v65.79,64.26 | v64.52,65.53 64.26,65.28 59.31,65.28 56.9,62.86 v56.26,62.86 | v53.59,60.2 53.59,52.7 v52.96,52.7 | v52.07,51.05 51.18,50.16 v51.05,50.16 | v51.05,48.39 51.05,40.64 v50.93,40.64 | v50.93,39.37 50.93,33.02 v53.34,33.02 | 61.21,22.86 61.21,23.88 v59.31,23.88 | 61.21,22.86 v61.21,20.07 | v57.4,25.78 57.4,28.32 57.28,28.32 55.88,29.72 U$46.14/A0 | v80.39,36.32 80.39,35.94 79.12,34.67 v79.12,32.51 86.61,32.51 v87.5,33.4 | v77.09,30.48 75.69,29.08 v74.04,29.08 | v72.14,27.18 71.25,26.29 67.18,26.29 v65.02,24.13 | 61.21,22.86 v63.75,22.86 | v116.71,30.1 116.46,30.35 v91.44,30.35 | v243.33,37.97 242.82,38.48 236.86,38.48 235.97,39.37 v235.97,47.24 | v366.78,55.88 365.12,57.53 356.11,57.53 353.06,60.58 332.61,60.58 v328.68,56.64 304.42,56.64 303.02,58.04 294.26,58.04 v293.24,57.02 293.24,57.15 284.86,57.15 283.97,58.04 262.13,58.04 261.62,57.53 246.38,57.53 245.87,58.04 238.89,58.04 v232.03,51.18 227.97,51.18 227.33,51.82 226.44,51.82 226.19,51.56 220.09,51.56 v217.17,54.48 217.17,54.36 216.92,54.36 v214.38,51.82 | v169.42,37.97 170.43,38.99 179.2,38.99 179.71,38.48 v181.23,38.48 | v182.5,38.48 185.04,41.02 v192.02,41.02 | v193.8,42.8 199.01,48.01 v210.57,48.01
GND  (via drill 0.3)
  Top 0.254: U1.TAB 78.24,58.28 U1.5 74.81,58.28 74.68,58.29 73.53,58.29 72.77,59.05 v72.52,58.93 | U1.15 77.74,56.78 U1.TAB | U1.35 80.74,59.78 U1.TAB | v77.6,50.42 77.64,50.38 U$60.P$2 77.72,49.02 79.5,47.24 U$60.P$4 | v74.8,50.42 74.8,50.67 | U1.TAB 76.74,59.78 U1.43 76.74,64.17 C13.2 77.34,64.9 77.34,67.56 U$61.B | v72.52,60.45 71.63,60.45 U$46.GND 70.99,61.09 | v334.26,36.96 334.26,38.73 C6.1 | v336.93,34.29 336.93,33.66 337.31,33.27 LED11.VSS | v338.84,47.5 341.38,50.04 LED18.4 341.5,50.16 v342.26,50.93 | v359.66,50.93 360.43,50.16 LED17.4 | v262,57.02 C9.1 | v263.14,54.99 265.81,52.32 LED8.VSS 265.94,52.2 v266.83,51.31 | v321.69,56.01 C11.1 | v322.71,53.34 322.71,52.58 322.96,52.32 LED10.VSS | v285.37,50.16 284.35,50.16 LED26.4 | v302.39,50.16 303.28,50.16 LED23.4 | v327.41,52.32 v328.8,50.93 | C8.1 148.46,55.37 148.65,55.18 | 150.69,53.15 151.51,52.32 LED4.VSS | 150.69,53.15 148.65,55.18 | v93.85,51.05 93.85,50.16 LED52.4 | v112.14,50.93 112.9,50.16 LED46.4 | v131.06,50.93 131.83,50.16 LED45.4 | v148.59,55.12 148.65,55.18 | v187.33,58.55 C10.1 | v190.63,53.21 189.74,52.32 LED6.VSS | v171.32,51.43 170.05,50.16 LED40.4 | v207.01,51.18 208.03,50.16 LED35.4 | 227.08,51.05 227.08,50.16 LED34.4 | v245.24,50.04 246.13,50.04 LED29.4 | 227.08,51.05 v228.22,49.91 | 227.08,51.05 v227.08,51.18 | v150.75,53.21 150.69,53.15 | v59.05,60.32 v60.32,61.59 60.32,61.47 v61.72,60.07 | v76.33,46.35 C16.2 | v78.74,46.35 79.76,47.37 U$60.P$4 | U$60.P$4 79.88,47.5 C15.2 v82.68,48.26 | v72.26,69.22 U$61.G1 | v76.2,68.2 76.71,68.2 77.22,67.69 U$61.B | U$61.G2 77.85,69.22 76.83,68.2 U$61.B | U1.TAB 78.87,57.78 81.28,55.37 82.04,55.37 U1.23 82.04,55.24 v82.68,54.61
  Top 0.254: 67.31,53.09 66.67,53.09 65.91,52.32 LED3.VSS 65.79,52.2 v64.39,52.2 | 67.31,53.09 C14.2 | 49.28,50.04 C12.1 | 67.31,53.09 v65.91,54.48 | v271.53,37.97 C5.1 272.42,38.86 v272.42,43.56 | v275.21,34.29 275.21,33.4 275.34,33.27 LED9.VSS | v256.79,32.13 255.78,31.12 LED28.4 255.65,30.99 v254.76,30.99 | v293.75,32.51 293.75,31.12 LED24.4 293.88,30.99 v294.89,30.99 | v311.91,30.99 312.8,30.99 LED22.4 | v196.85,37.97 C4.1 | v198.76,34.29 198.76,33.66 199.14,33.27 LED7.VSS 199.26,33.15 201.17,31.24 v201.17,31.12 | v216.79,30.23 217.55,30.99 LED33.4 | v235.84,30.23 236.6,30.99 LED30.4 | C3.1 138.94,36.32 141.16,34.1 | 141.16,34.1 141.99,33.27 LED5.VSS | v159.51,31.12 160.4,31.12 LED41.4 | v141.22,34.16 141.16,34.1 | v178.56,30.99 179.45,30.99 LED37.4 | C1.1 11.94,36.32 14.16,34.1 | 14.16,34.1 14.99,33.27 LED1.VSS | v26.29,31.88 27.05,31.12 LED56.4 | v14.22,34.16 14.16,34.1 | v45.21,30.99 46.1,30.99 LED54.4 | C2.1 62.74,36.32 65.79,33.27 LED2.VSS 65.91,33.15 v66.8,32.26 | v83.31,31.12 84.2,31.12 LED51.4 | v102.36,30.99 103.25,30.99 LED47.4 | v121.41,30.99 122.3,30.99 LED44.4 | v377.82,37.97 C7.1 | v379.73,34.29 379.73,33.66 380.11,33.27 LED12.VSS | v361.31,31.88 360.55,31.12 LED15.4 | v380.37,49.28 379.6,50.04 LED16.4 | v18.67,11.43 17.65,11.43 LED57.4 | v35.69,11.43 36.58,11.43 LED55.4 | v54.74,11.43 55.63,11.43 LED53.4 | v73.79,11.43 74.68,11.43 LED50.4 | v92.84,11.43 93.73,11.43 LED49.4 | v111.89,11.43 112.78,11.43 LED48.4 | v130.94,11.43 131.83,11.43 LED43.4 | v149.99,11.43 150.88,11.43 LED42.4 | v169.04,11.43 169.93,11.43 LED39.4 | v188.09,11.43 188.98,11.43 LED38.4 | v207.14,11.43 208.03,11.43 LED36.4 | v226.19,11.43 227.08,11.43 LED32.4
  Top 0.254: v245.24,11.43 246.13,11.43 LED31.4 | v264.29,11.3 265.18,11.3 LED27.4 | v283.34,11.3 284.23,11.3 LED25.4 | v302.39,11.3 303.28,11.3 LED20.4 | v321.44,11.3 322.33,11.3 LED21.4 | v340.49,11.3 341.38,11.3 LED19.4 | v359.54,11.3 360.43,11.3 LED14.4 | v378.59,11.3 379.48,11.3 LED13.4
  Bottom 0.254: v77.6,50.42 v74.8,50.42 | v72.52,58.93 72.52,59.69 | 72.52,59.69 v72.52,60.45 | v336.93,34.29 334.71,36.51 | 334.71,36.51 v334.26,36.96 | v338.84,47.5 338.84,36.58 334.77,36.58 334.71,36.51 | v359.66,50.93 v342.26,50.93 v328.8,50.93 | v262,57.02 262,54.99 v263.14,54.99 | 272.42,50.16 v285.37,50.16 v302.39,50.16 315.98,50.16 321.69,55.88 v321.69,56.01 322.71,54.99 v322.71,53.34 326.39,53.34 v327.41,52.32 | 272.42,50.16 267.97,50.16 v266.83,51.31 266.83,51.18 265.68,50.04 v245.24,50.04 245.11,49.91 v228.22,49.91 | v93.85,51.05 94.87,50.04 111.25,50.04 111.57,50.36 | v112.14,50.93 111.57,50.36 | 111.57,50.36 111.63,50.29 130.43,50.29 v131.06,50.93 133.99,50.93 138.3,55.24 148.46,55.24 v148.59,55.12 | v190.63,53.21 190.63,54.48 | 190.63,54.48 190.63,55.24 v187.33,58.55 187.33,58.42 180.21,51.31 171.45,51.31 v171.32,51.43 171.32,51.31 152.65,51.31 v150.75,53.21 | 190.63,54.48 195.2,54.48 198.12,51.56 206.63,51.56 v207.01,51.18 v227.08,51.18 | U$46.AGND 57.78,60.32 v59.05,60.32 | v60.32,61.59 62.23,63.5 JP1.GND | v78.74,46.35 v76.33,46.35 | v72.26,69.22 73.28,68.2 v76.2,68.2 | v82.68,54.61 v82.68,48.26 | v61.72,60.07 62.1,59.69 66.17,59.69 | 72.52,59.69 66.17,59.69 | v64.39,52.2 64.39,51.43 64.52,51.31 64.52,50.55 64.26,50.55 62.74,49.02 ISP1.6 61.72,48.13 59.31,48.13 57.91,49.53 49.78,49.53 | 66.17,59.69 66.17,54.48 v65.91,54.48 | v256.79,32.13 257.05,31.88 264.67,31.88 270.64,37.85 271.53,37.85 v271.53,37.97 v275.21,34.29 277.24,32.26 293.5,32.26 v293.75,32.51 | v294.89,30.99 v311.91,30.99 | v196.85,37.97 198.37,37.97 198.76,37.59 v198.76,34.29 | v141.22,34.16 142.3,33.08
  Bottom 0.254: 142.3,33.08 144.15,31.24 159.39,31.24 v159.51,31.12 159.64,30.99 v178.56,30.99 201.04,30.99 v201.17,31.12 215.9,31.12 v216.79,30.23 v235.84,30.23 236.35,30.73 254.51,30.73 v254.76,30.99 | 65.15,31.5 65.15,32 66.93,32 v66.8,32.26 67.56,31.5 82.93,31.5 v83.31,31.12 102.23,31.12 v102.36,30.99 v121.41,30.99 140.21,30.99 142.3,33.08 | 65.15,31.5 65.15,30.61 64.77,30.23 63.5,30.23 U$46.GND1 63.5,27.18 63.75,26.92 63.75,23.5 64.14,23.5 64.52,23.11 64.52,11.43 | 65.15,31.5 45.72,31.5 v45.21,30.99 40,30.99 39.24,30.23 27.94,30.23 v26.29,31.88 25.65,32.51 24.64,32.51 24.38,32.77 15.62,32.77 v14.22,34.16 14.35,34.16 14.35,34.92 15.75,36.32 | v272.42,43.56 272.42,50.16 | v361.31,31.88 363.09,33.66 379.1,33.66 379.16,33.72 | 379.16,33.72 v379.73,34.29 379.73,36.07 v377.82,37.97 380.37,37.97 v380.37,49.28 | v18.67,11.43 v35.69,11.43 v54.74,11.43 64.52,11.43 | 64.52,11.43 v73.79,11.43 v92.84,11.43 v111.89,11.43 v130.94,11.43 v149.99,11.43 v169.04,11.43 v188.09,11.43 v207.14,11.43 v226.19,11.43 v245.24,11.43 264.16,11.43 v264.29,11.3 v283.34,11.3 v302.39,11.3 302.51,11.43 321.31,11.43 v321.44,11.3 v340.49,11.3 v359.54,11.3 360.3,10.54 362.33,10.54 362.46,10.67 377.95,10.67 v378.59,11.3 379.98,11.3 379.98,14.73 382.27,17.02 382.4,17.02 382.4,30.48 379.16,33.72
  pour Top: -10.41,82.17 -6.03,-10.48 409.89,-9.21 406.15,100.9
LED  (via drill 0.3)
  Top 0.254: U1.27 84.07,57.28 v84.96,56.39 85.6,55.75 85.6,54.48 v83.82,52.7 | v16,35.69 15.11,36.58 LED1.DIN | v24.13,32.13 v22.86,33.4 | v57.66,24.26 v56.77,25.15 | v63.12,24.51 64.39,24.51 v65.15,25.27 | v86.11,46.61 v84.45,48.26 | v82.55,41.66 v82.55,43.05 | v74.93,34.54 v76.83,36.45 | v72.52,30.48 v72.52,32.13
  Bottom 0.254: v84.96,56.39 85.72,56.39 | v16,35.69 18.29,33.4 v22.86,33.4 | v24.13,32.13 26.42,29.85 41.27,29.85 41.4,29.97 43.05,29.97 45.34,27.69 54.23,27.69 v56.77,25.15 | v57.66,24.26 57.91,24.51 v63.12,24.51 | v65.15,25.27 67.82,27.94 U$46.VBAT 69.6,28.96 72.52,28.96 v72.52,30.48 | v83.82,52.7 84.45,52.07 v84.45,48.26 | v82.55,43.05 v86.11,46.61 | v82.55,41.66 81.53,40.64 79.76,40.64 76.83,37.72 v76.83,36.45 | v72.52,32.13 v74.93,34.54
MIDI1  (via drill 0.3)
  Top 0.254: U1.21 80.74,53.75 v81.79,52.7 | v50.29,53.34 50.55,53.34 54.23,57.02 v55.24,57.02 | v62.61,52.45 v59.18,55.88 | v67.44,54.1 67.69,53.85 68.96,53.85 70.99,55.88 U$46.1 | v34.92,52.07 34.07,52.07 IC1.1
  Bottom 0.254: v81.79,52.7 81.79,54.36 79.63,56.52 71.75,56.52 U$46.1 | v55.24,57.02 55.37,56.9 58.17,56.9 v59.18,55.88 | v62.61,52.45 63.63,53.47 66.8,53.47 v67.44,54.1 | v50.29,53.34 48.89,53.34 47.62,52.07 v34.92,52.07
MIDI2  (via drill 0.3)
  Top 0.254: U1.20 80.24,53.11 v80.77,52.58 | v45.08,30.23 v42.42,32.89 | v54.61,28.32 55.24,28.96 v57.53,28.96 | v64.52,30.86 65.53,29.85 66.04,29.85 v68.33,32.13 | v33.66,38.73 v33.66,41.27 | v30.16,42.54 IC1.11
  Bottom 0.254: v80.77,52.58 80.77,43.05 74.04,36.32 74.04,35.94 U$46.10 70.23,32.13 v68.33,32.13 | v42.42,32.89 39.62,32.89 34.67,37.85 34.54,37.85 v33.66,38.73 | v45.08,30.23 46.99,28.32 v54.61,28.32 | v57.53,28.96 59.44,30.86 v64.52,30.86 | v33.66,41.27 31.43,41.27 v30.16,42.54
MISO  (via drill 0.3)
  Top 0.254: U1.11 74.84,55.03 v72.9,53.09
  Bottom 0.254: v72.9,53.09 72.9,52.83 72.26,52.2 68.58,52.2 66.42,50.04 66.42,47.75 ISP1.1
MODE  (via drill 0.3)
  Top 0.254: U1.25 83.29,56.28 v83.82,55.75 | v84.45,61.34 v84.45,65.02 | U$61.A 74.5,67.06 v74.8,67.06 74.17,66.42 R11.2 | v83.31,53.34 v80.14,50.16
  Bottom 0.254: v84.45,61.34 83.82,60.71 v83.82,55.75 83.82,55.5 83.31,54.99 v83.31,53.34 | v84.45,65.02 84.45,65.53 82.93,67.06 v74.8,67.06 | U$46.5 73.91,48.51 78.49,48.51 v80.14,50.16
MOSI  (via drill 0.3)
  Top 0.254: U1.10 74.2,55.66 v73.53,54.99
  Bottom 0.254: v73.53,54.99 73.15,54.61 69.47,54.61 65.28,50.42 65.28,49.15 ISP1.4
N$1  (via drill 0.3)
  Top 0.254: v24.26,12.83 25.4,13.97 D1.C
  Bottom 0.254: v24.26,12.83 23.5,12.07 15.75,12.07 15.24,11.56 14.73,11.56 12.07,14.22 SW46.1
N$2  (via drill 0.3)
  Top 0.254: v33.4,36.83 34.92,36.83 D2.C
  Bottom 0.254: v33.4,36.83 32.77,37.46 SW47.1
N$3  (via drill 0.3)
  Top 0.254: v43.18,15.37 44.45,14.1 D3.C | v40.13,18.41 v41.02,17.53
  Bottom 0.254: v41.02,17.53 v43.18,15.37 | SW48.1 v40.13,18.41
N$4  (via drill 0.3)
  Top 0.254: v41.4,43.31 42.54,44.45 D4.C | v41.4,39.37 v41.4,40.64
  Bottom 0.254: v41.4,40.64 v41.4,43.31 | v41.4,39.37 41.4,37.46 SW49.1
N$5  (via drill 0.3)
  Top 0.254: v78.74,17.91 82.55,14.1 D5.C
  Bottom 0.254: v78.74,17.91 78.23,18.41 SW51.1
N$6  (via drill 0.3)
  Top 0.254: v88.27,36.96 92.08,33.15 D6.C
  Bottom 0.254: v88.27,36.96 87.76,37.46 SW52.1
N$7  (via drill 0.3)
  Top 0.254: v100.33,15.37 101.6,14.1 D7.C
  Bottom 0.254: v100.33,15.37 97.28,18.41 SW53.1
N$8  (via drill 0.3)
  Top 0.254: v119.38,15.37 120.65,14.1 D8.C
  Bottom 0.254: v119.38,15.37 116.33,18.41 SW55.1
N$9  (via drill 0.3)
  Top 0.254: v126.49,36.83 130.18,33.15 D9.C
  Bottom 0.254: v126.49,36.83 125.86,37.46 SW56.1
N$10  (via drill 0.3)
  Top 0.254: v102.87,53.47 101.6,52.2 D10.C
  Bottom 0.254: v102.87,53.47 105.92,56.52 SW90.1
N$11  (via drill 0.3)
  Top 0.254: v121.92,53.47 120.65,52.2 D11.C
  Bottom 0.254: v121.92,53.47 124.97,56.52 SW88.1
N$12  (via drill 0.3)
  Top 0.254: v156.08,16.76 158.75,14.1 D12.C
  Bottom 0.254: v156.08,16.76 154.43,18.41 SW58.1
N$13  (via drill 0.3)
  Top 0.254: v150.5,34.42 149.23,33.15 D13.C
  Bottom 0.254: v150.5,34.42 153.54,37.46 SW59.1
N$14  (via drill 0.3)
  Top 0.254: v160.66,54.1 158.75,52.2 D14.C
  Bottom 0.254: v160.66,54.1 163.07,56.52 SW83.1
N$15  (via drill 0.3)
  Top 0.254: v195.58,15.37 196.85,14.1 D15.C
  Bottom 0.254: v195.58,15.37 192.53,18.41 SW62.1
N$16  (via drill 0.3)
  Top 0.254: v207.65,34.42 206.38,33.15 D16.C
  Bottom 0.254: v207.65,34.42 210.69,37.46 SW64.1
N$17  (via drill 0.3)
  Top 0.254: v198.12,53.47 196.85,52.2 D17.C
  Bottom 0.254: v198.12,53.47 201.17,56.52 SW81.1
N$18  (via drill 0.3)
  Top 0.254: v214.63,15.37 215.9,14.1 D18.C
  Bottom 0.254: v214.63,15.37 211.58,18.41 SW63.1
N$19  (via drill 0.3)
  Top 0.254: v176.66,12.83 177.8,13.97 D19.C
  Bottom 0.254: v176.66,12.83 176.53,12.7 168.02,12.7 164.47,16.26 SW60.1
N$20  (via drill 0.3)
  Top 0.254: v109.86,34.42 111.12,33.15 D20.C | v106.81,37.46 v107.7,36.58
  Bottom 0.254: v107.7,36.58 v109.86,34.42 | SW54.1 v106.81,37.46
N$21  (via drill 0.3)
  Top 0.254: v233.68,15.37 234.95,14.1 D21.C
  Bottom 0.254: v233.68,15.37 230.63,18.41 SW65.1
N$22  (via drill 0.3)
  Top 0.254: v236.22,53.47 234.95,52.2 D22.C
  Bottom 0.254: v236.22,53.47 239.27,56.52 SW78.1
N$23  (via drill 0.3)
  Top 0.254: v252.22,15.88 254,14.1 D23.C
  Bottom 0.254: v252.22,15.88 249.68,18.41 SW67.1
N$24  (via drill 0.3)
  Top 0.254: v226.7,34.42 225.43,33.15 D24.C
  Bottom 0.254: v226.7,34.42 229.74,37.46 SW66.1
N$25  (via drill 0.3)
  Top 0.254: v271.78,15.37 273.05,14.1 D25.C
  Bottom 0.254: v271.78,15.37 268.73,18.41 SW69.1
N$26  (via drill 0.3)
  Top 0.254: v285.75,36.32 282.57,33.15 D26.C
  Bottom 0.254: v285.75,36.32 286.89,37.46 SW71.1
N$27  (via drill 0.3)
  Top 0.254: v274.19,57.02 273.05,55.88 D27.C
  Bottom 0.254: v274.19,57.02 274.7,56.52 SW79.1
N$28  (via drill 0.3)
  Top 0.254: v274.19,19.18 273.05,20.32 D28.C
  Bottom 0.254: v274.19,19.18 274.95,18.41 SW70.1
N$29  (via drill 0.3)
  Top 0.254: v62.23,15.37 63.5,14.1 D29.C
  Bottom 0.254: v62.23,15.37 59.18,18.41 SW50.1
N$30  (via drill 0.3)
  Top 0.254: v138.43,15.37 139.7,14.1 D30.C
  Bottom 0.254: v138.43,15.37 135.38,18.41 SW57.1
N$31  (via drill 0.3)
  Top 0.254: v218.19,54.48 215.9,52.2 D31.C
  Bottom 0.254: v218.19,54.48 220.22,56.52 SW82.1
N$32  (via drill 0.3)
  Top 0.254: v169.8,34.67 168.28,33.15 D32.C
  Bottom 0.254: v169.8,34.67 172.59,37.46 SW61.1
N$33  (via drill 0.3)
  Top 0.254: v89.03,49.28 88.27,48.51 88.27,44.45 D33.C | v89.28,53.59 89.28,55.5 SW89.1
  Bottom 0.254: v89.03,49.28 89.03,53.59 v89.28,53.59
N$34  (via drill 0.3)
  Top 0.254: v245.75,34.42 244.48,33.15 D34.C
  Bottom 0.254: v245.75,34.42 248.79,37.46 SW68.1
N$35  (via drill 0.3)
  Top 0.254: v293.37,53.47 292.1,52.2 D35.C
  Bottom 0.254: v293.37,53.47 296.42,56.52 SW85.1
N$36  (via drill 0.3)
  Top 0.254: v293.37,15.37 292.1,14.1 D36.C
  Bottom 0.254: v293.37,15.37 296.42,18.41 SW72.1
N$37  (via drill 0.3)
  Top 0.254: v312.42,15.37 311.15,14.1 D37.C
  Bottom 0.254: v312.42,15.37 315.47,18.41 SW74.1
N$38  (via drill 0.3)
  Top 0.254: v331.47,15.37 330.2,14.1 D38.C
  Bottom 0.254: v331.47,15.37 334.52,18.41 SW80.1
N$39  (via drill 0.3)
  Top 0.254: v302.9,34.42 301.62,33.15 D39.C
  Bottom 0.254: v302.9,34.42 305.94,37.46 SW73.1
N$40  (via drill 0.3)
  Top 0.254: v331.47,53.47 330.2,52.2 D40.C
  Bottom 0.254: v331.47,53.47 334.52,56.52 SW84.1
N$41  (via drill 0.3)
  Top 0.254: v350.52,15.37 349.25,14.1 D41.C
  Bottom 0.254: v350.52,15.37 353.57,18.41 SW77.1
N$42  (via drill 0.3)
  Top 0.254: v350.52,53.47 349.25,52.2 D42.C
  Bottom 0.254: v350.52,53.47 353.57,56.52 SW86.1
N$43  (via drill 0.3)
  Top 0.254: v369.57,15.37 368.3,14.1 D43.C
  Bottom 0.254: v369.57,15.37 372.62,18.41 SW75.1
N$44  (via drill 0.3)
  Top 0.254: v350.52,34.42 349.25,33.15 D44.C
  Bottom 0.254: v350.52,34.42 353.57,37.46 SW76.1
N$45  (via drill 0.3)
  Top 0.254: v369.57,53.47 368.3,52.2 D45.C
  Bottom 0.254: v369.57,53.47 372.62,56.52 SW87.1
N$46
  Top 0.254: R2.2 38.23,47.43 D46.+
N$47  (via drill 0.3)
  Top 0.254: v64.01,42.93 64.01,49.15 61.21,51.94 61.21,52.2 LED3.DOUT | v81.41,45.59 v80.01,44.2 | v146.43,50.8 v145.54,51.69 | v150.62,54.74 151.51,55.63 LED4.DIN
  Bottom 0.254: v64.01,42.93 69.34,42.93 70.61,44.2 v80.01,44.2 | v81.41,45.59 82.04,46.23 82.3,46.23 83.06,46.99 83.06,47.62 90.8,47.62 92.84,49.66 143.51,49.66 v145.54,51.69 | v146.43,50.8 150.37,54.74 v150.62,54.74
N$48  (via drill 0.3)
  Top 0.254: v357.89,10.54 357.12,11.3 LED14.1 | v378.71,10.29 379.48,9.52 LED13.3
  Bottom 0.254: v357.89,10.54 358.27,10.16 374.65,10.16 374.78,10.29 v378.71,10.29
N$49  (via drill 0.3)
  Top 0.254: v59.05,35.31 61.09,33.27 LED2.DOUT | v53.09,39.37 53.09,40 v52.45,40.64 | v52.45,50.16 v52.45,48.89 | v54.61,51.05 55.5,51.94 v59.56,51.94 | v64.9,56.52 65.79,55.63 LED3.DIN
  Bottom 0.254: v59.05,35.31 57.28,37.08 55.37,37.08 v53.09,39.37 | v52.45,48.89 v52.45,40.64 | v52.45,50.16 53.34,51.05 v54.61,51.05 | v59.56,51.94 64.14,56.52 v64.9,56.52
N$50  (via drill 0.3)
  Top 0.254: v11.3,32.26 10.41,33.15 LED1.DOUT | v61.34,30.23 61.34,31.75 v62.48,32.89 | v65.15,35.56 65.15,35.94 65.79,36.58 LED2.DIN
  Bottom 0.254: v11.3,32.26 14.48,29.08 41.02,29.08 42.8,27.3 53.72,27.3 56.52,24.51 57.02,24.51 59.94,27.43 59.94,30.23 v61.34,30.23 | v65.15,35.56 v62.48,32.89
N$51  (via drill 0.3)
  Top 0.254: v261.24,48.77 261.24,52.2 LED8.DOUT | v271.78,40.13 v270.89,41.02 | v274.45,37.59 275.34,36.7 LED9.DIN
  Bottom 0.254: v261.24,48.77 267.21,42.8 269.11,42.8 v270.89,41.02 | v271.78,40.13 274.32,37.59 v274.45,37.59
N$52  (via drill 0.3)
  Top 0.254: v186.06,51.18 185.04,52.2 LED6.DOUT | v188.34,45.59 v186.18,47.75 | v198.12,37.34 198.5,37.34 199.14,36.7 LED7.DIN
  Bottom 0.254: v186.06,51.18 186.06,47.75 v186.18,47.75 | v188.34,45.59 196.6,37.34 v198.12,37.34
N$53  (via drill 0.3)
  Top 0.254: v138.3,34.16 137.41,33.27 LED5.DOUT | v147.19,37.34 v145.92,36.07 | v162.81,47.75 v161.54,46.48 | v188.59,54.61 189.61,55.63 LED6.DIN
  Bottom 0.254: v138.3,34.16 140.21,36.07 v145.92,36.07 | v147.19,37.34 156.34,46.48 v161.54,46.48 | v162.81,47.75 181.61,47.75 188.47,54.61 v188.59,54.61
N$54  (via drill 0.3)
  Top 0.254: v143,37.59 142.11,36.7 LED5.DIN | v144.27,47.75 v143,46.48 | v147.83,51.31 146.94,52.2 LED4.DOUT
  Bottom 0.254: v143,46.48 v143,37.59 | v147.83,51.31 v144.27,47.75
N$55
  Top 0.254: IC1.5 28.89,50.8 29.53,50.16 31.12,50.16 31.43,50.48 IC1.3 IC1.2
N$56
  Top 0.254: IC1.9 IC1.10 28.89,47.31 29.53,47.94 32.07,47.94 32.7,47.31 IC1.13
N$57  (via drill 0.3)
  Top 0.254: R1.1 21.59,45.72 v21.91,46.04 | IC1.6 27.62,50.48 v27.3,50.16
  Bottom 0.254: v27.3,50.16 27.3,48.89 26.67,48.26 24.13,48.26 v21.91,46.04